# Altium schematic sheet PLL.SchDoc
size 420 x 297 mm; SheetNumber: 6; SheetTotal: 7
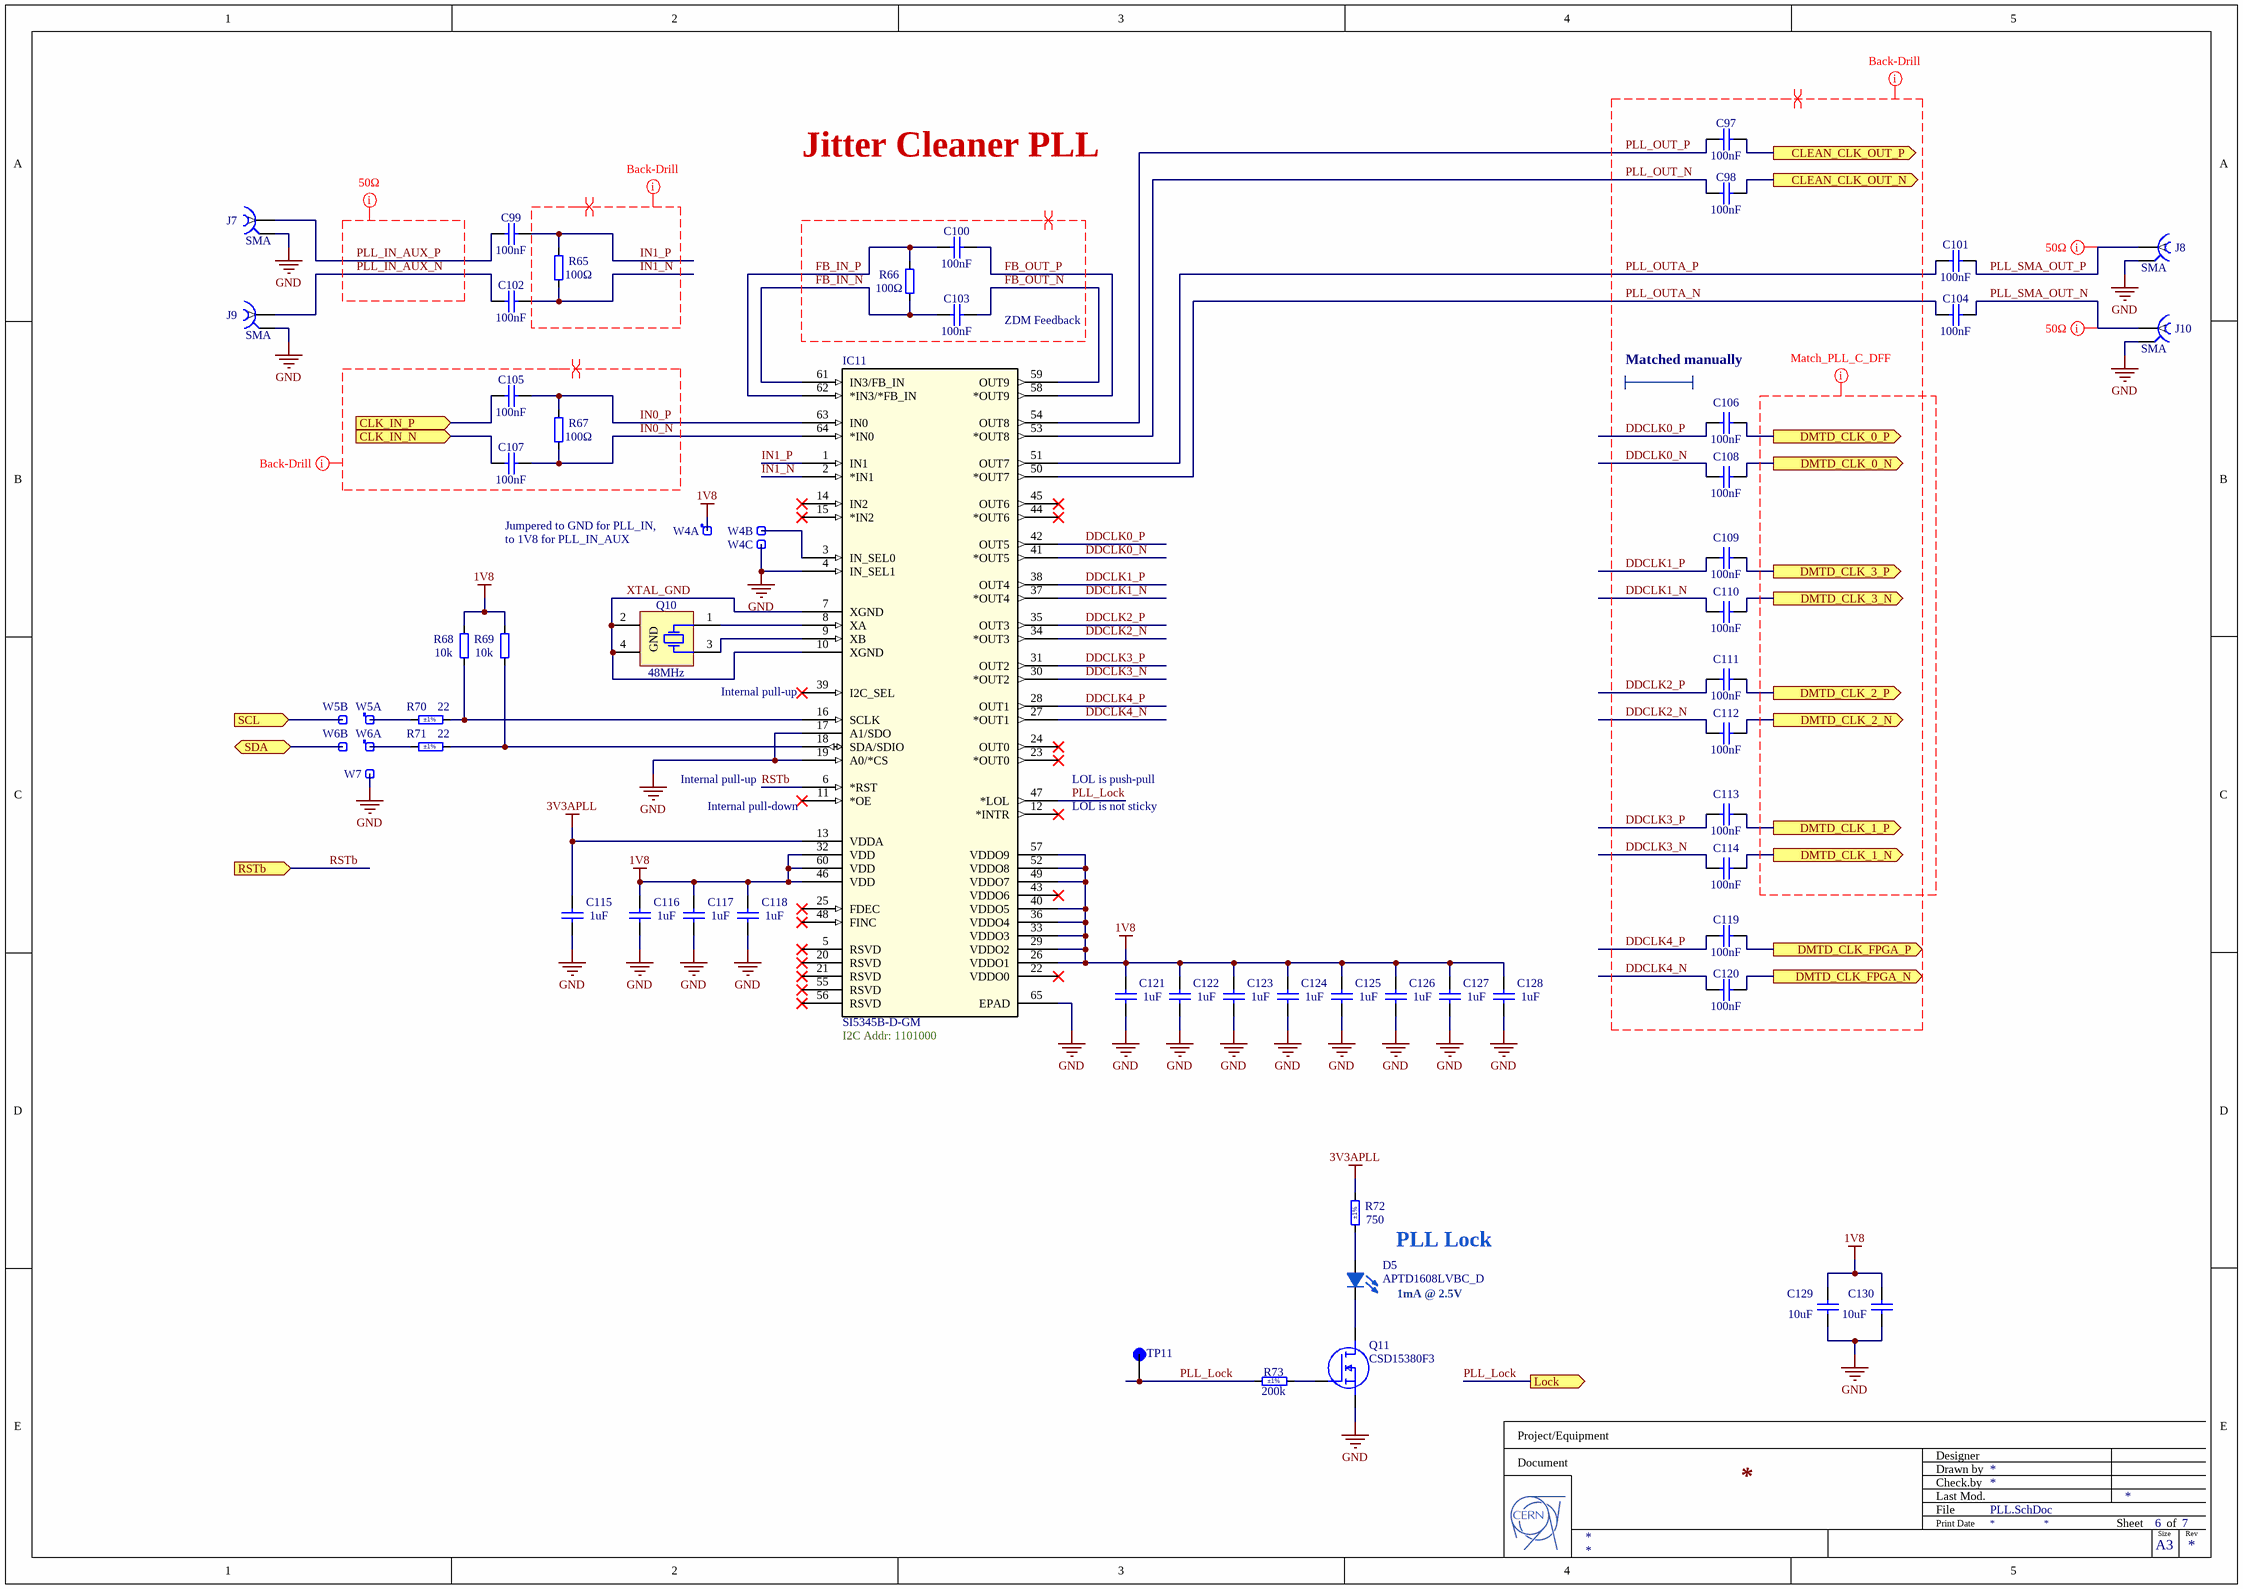
[diagram p0: PLL.SchDoc]

## Parts
C97  100nF  [MURATA_HI_DENSITY_0201]
C98  100nF  [MURATA_HI_DENSITY_0201]
C99  100nF  [MURATA_HI_DENSITY_0201]
C100  100nF  [MURATA_HI_DENSITY_0201]
C101  100nF  [MURATA_HI_DENSITY_0201]
C102  100nF  [MURATA_HI_DENSITY_0201]
C103  100nF  [MURATA_HI_DENSITY_0201]
C104  100nF  [MURATA_HI_DENSITY_0201]
C105  100nF  [MURATA_HI_DENSITY_0201]
C106  100nF  [MURATA_HI_DENSITY_0201]
C107  100nF  [MURATA_HI_DENSITY_0201]
C108  100nF  [MURATA_HI_DENSITY_0201]
C109  100nF  [MURATA_HI_DENSITY_0201]
C110  100nF  [MURATA_HI_DENSITY_0201]
C111  100nF  [MURATA_HI_DENSITY_0201]
C112  100nF  [MURATA_HI_DENSITY_0201]
C113  100nF  [MURATA_HI_DENSITY_0201]
C114  100nF  [MURATA_HI_DENSITY_0201]
C115  1uF  [CAPC1005X55N]
C116  1uF  [CAPC1005X55N]
C117  1uF  [CAPC1005X55N]
C118  1uF  [CAPC1005X55N]
C119  100nF  [MURATA_HI_DENSITY_0201]
C120  100nF  [MURATA_HI_DENSITY_0201]
C121  1uF  [CAPC1005X55N]
C122  1uF  [CAPC1005X55N]
C123  1uF  [CAPC1005X55N]
C124  1uF  [CAPC1005X55N]
C125  1uF  [CAPC1005X55N]
C126  1uF  [CAPC1005X55N]
C127  1uF  [CAPC1005X55N]
C128  1uF  [CAPC1005X55N]
C129  10uF  [CAPC1608X87N]
C130  10uF  [CAPC1608X87N]
D5  APTD1608LVBC_D  [LEDC1608X110N]
IC11  SI5345B-D-GM  [QFN50P900X900X90-65N-D]
J7  SMA  [SAMTEC_SMA-J-P-H-ST-MT1]
J8  SMA  [SAMTEC_SMA-J-P-H-ST-MT1]
J9  SMA  [SAMTEC_SMA-J-P-H-ST-MT1]
J10  SMA  [SAMTEC_SMA-J-P-H-ST-MT1]
Q10  48MHz  [XTAL_KYOCERA_CX3225SB]
Q11  CSD15380F3  [CSD15380F3]
R65  100Ω  [MURATA_HI_DENSITY_0201]
R66  100Ω  [MURATA_HI_DENSITY_0201]
R67  100Ω  [MURATA_HI_DENSITY_0201]
R68  10k  [MURATA_HI_DENSITY_0201]
R69  10k  [MURATA_HI_DENSITY_0201]
R70  22  Tolerance: ±1%  [RESC1005X40N]
R71  22  Tolerance: ±1%  [RESC1005X40N]
R72  750  Tolerance: ±1%  [RESC1005X40N]
R73  200k  Tolerance: ±1%  [RESC1005X40N]
TP11  RCU-0C  [TP+195X110]  (value not drawn)
W4  Header 3  [SAMTEC_HTSW-103-23-L-S]  (value not drawn)  (parts A,B,C of 3)
W5  Header 2  [SAMTEC_HTSW-102-23-L-S]  (value not drawn)  (parts A,B of 2)
W6  Header 2  [SAMTEC_HTSW-102-23-L-S]  (value not drawn)  (parts A,B of 2)
W7  Header 1  [SAMTEC_HTSW-101-23-L-S]  (value not drawn)

## Ports
CLEAN_CLK_OUT_N (out), CLEAN_CLK_OUT_P (out), CLK_IN_N (in), CLK_IN_P (in), DMTD_CLK_0_N (out), DMTD_CLK_0_P (out), DMTD_CLK_1_N (out), DMTD_CLK_1_P (out), DMTD_CLK_2_N (out), DMTD_CLK_2_P (out), DMTD_CLK_3_N (out), DMTD_CLK_3_P (out), DMTD_CLK_FPGA_N (out), DMTD_CLK_FPGA_P (out), Lock (out), RSTb (in), SCL (in), SDA (bidir)

## Nets
1V8: C116.2 C117.2 C118.2 C121.2 C122.2 C123.2 C124.2 C125.2 C126.2 C127.2 C128.2 C129.2 C130.2 IC11.26(VDDO1) IC11.29(VDDO2) IC11.32(VDD) IC11.33(VDDO3) IC11.36(VDDO4) IC11.40(VDDO5) IC11.46(VDD) IC11.49(VDDO7) IC11.52(VDDO8) IC11.57(VDDO9) IC11.60(VDD) R68.2 R69.2 W4.1
3V3APLL: C115.2 IC11.13(VDDA) R72.2
GND: C115.1 C116.1 C117.1 C118.1 C121.1 C122.1 C123.1 C124.1 C125.1 C126.1 C127.1 C128.1 C129.1 C130.1 IC11.4(IN_SEL1) IC11.17(A1/SDO) IC11.19(A0/*CS) IC11.65(EPAD) J7.2 J8.2 J9.2 J10.2 Q11.2(S) W4.3 W7.1
CLEAN_CLK_OUT_N: C98.2 ; port CLEAN_CLK_OUT_N
CLEAN_CLK_OUT_P: C97.2 ; port CLEAN_CLK_OUT_P
CLK_IN_N: C107.2 ; port CLK_IN_N
CLK_IN_P: C105.2 ; port CLK_IN_P
DDCLK0_N: C108.1 IC11.41(*OUT5)
DDCLK0_P: C106.1 IC11.42(OUT5)
DDCLK1_N: C110.1 IC11.37(*OUT4)
DDCLK1_P: C109.1 IC11.38(OUT4)
DDCLK2_N: C112.1 IC11.34(*OUT3)
DDCLK2_P: C111.1 IC11.35(OUT3)
DDCLK3_N: C114.1 IC11.30(*OUT2)
DDCLK3_P: C113.1 IC11.31(OUT2)
DDCLK4_N: C120.1 IC11.27(*OUT1)
DDCLK4_P: C119.1 IC11.28(OUT1)
DMTD_CLK_0_N: C108.2 ; port DMTD_CLK_0_N
DMTD_CLK_0_P: C106.2 ; port DMTD_CLK_0_P
DMTD_CLK_1_N: C114.2 ; port DMTD_CLK_1_N
DMTD_CLK_1_P: C113.2 ; port DMTD_CLK_1_P
DMTD_CLK_2_N: C112.2 ; port DMTD_CLK_2_N
DMTD_CLK_2_P: C111.2 ; port DMTD_CLK_2_P
DMTD_CLK_3_N: C110.2 ; port DMTD_CLK_3_N
DMTD_CLK_3_P: C109.2 ; port DMTD_CLK_3_P
DMTD_CLK_FPGA_N: C120.2 ; port DMTD_CLK_FPGA_N
DMTD_CLK_FPGA_P: C119.2 ; port DMTD_CLK_FPGA_P
FB_IN_N: C103.1 IC11.61(IN3/FB_IN) R66.1
FB_IN_P: C100.1 IC11.62(*IN3/*FB_IN) R66.2
FB_OUT_N: C103.2 IC11.59(OUT9)
FB_OUT_P: C100.2 IC11.58(*OUT9)
IN0_N: C107.1 IC11.64(*IN0) R67.1
IN0_P: C105.1 IC11.63(IN0) R67.2
IN1_N: C102.1 IC11.2(*IN1) R65.1
IN1_P: C99.1 IC11.1(IN1) R65.2
PLL_IN_AUX_N: C102.2 J9.1
PLL_IN_AUX_P: C99.2 J7.1
PLL_Lock: IC11.47(*LOL) R73.1 TP11.1(TP) ; port Lock
PLL_OUT_N: C98.1 IC11.53(*OUT8)
PLL_OUT_P: C97.1 IC11.54(OUT8)
PLL_OUTA_N: C104.1 IC11.50(*OUT7)
PLL_OUTA_P: C101.1 IC11.51(OUT7)
PLL_SMA_OUT_N: C104.2 J10.1
PLL_SMA_OUT_P: C101.2 J8.1
RSTb: IC11.6(*RST) ; port RSTb
SCL: W5.2 ; port SCL
SDA: W6.2 ; port SDA
XTAL_GND: IC11.7(XGND) IC11.10(XGND) Q10.2(GND) Q10.4(GND)
NetD5_1: D5.1(K) Q11.3(D)
NetD5_2: D5.2(A) R72.1
NetIC11_3: IC11.3(IN_SEL0) W4.2
NetIC11_8: IC11.8(XA) Q10.1(X)
NetIC11_9: IC11.9(XB) Q10.3(X)
NetIC11_16: IC11.16(SCLK) R68.1 R70.2
NetIC11_18: IC11.18(SDA/SDIO) R69.1 R71.2
NetQ11_1: Q11.1(G) R73.2
NetR70_1: R70.1 W5.1
NetR71_1: R71.1 W6.1

Not connected (* = marked no-connect by the designer): IC11 5(RSVD)* 11(*OE)* 12(*INTR)* 14(IN2)* 15(*IN2)* 20(RSVD)* 21(RSVD)* 22(VDDO0)* 23(*OUT0)* 24(OUT0)* 25(FDEC)* 39(I2C_SEL)* 43(VDDO6)* 44(*OUT6)* 45(OUT6)* 48(FINC)* 55(RSVD)* 56(RSVD)*

## Layout directives
differential pair: DDCLK0_N, DDCLK0_P, DDCLK1_N, DDCLK1_P, DDCLK2_N, DDCLK2_P, DDCLK3_N, DDCLK3_P, DDCLK4_N, DDCLK4_P, FB_IN_N, FB_IN_P, FB_OUT_N, FB_OUT_P, IN0_N, IN0_P, IN1_N, IN1_P, PLL_OUT_N, PLL_OUT_P, PLL_OUTA_N, PLL_OUTA_P
net class 50ohm: PLL_IN_AUX_N, PLL_IN_AUX_P, PLL_SMA_OUT_N, PLL_SMA_OUT_P
net class Back-Drill: DDCLK0_N, DDCLK0_P, DDCLK1_N, DDCLK1_P, DDCLK2_N, DDCLK2_P, DDCLK3_N, DDCLK3_P, DDCLK4_N, DDCLK4_P, IN0_N, IN0_P, IN1_N, IN1_P, PLL_OUT_N, PLL_OUT_P, PLL_OUTA_N, PLL_OUTA_P
net class Match_PLL_C_DFF: DDCLK0_N, DDCLK0_P, DDCLK1_N, DDCLK1_P, DDCLK2_N, DDCLK2_P, DDCLK3_N, DDCLK3_P, DDCLK4_N, DDCLK4_P, PLL_OUT_N, PLL_OUT_P, PLL_OUTA_N, PLL_OUTA_P

## Notes on the sheet
- Jitter Cleaner PLL
- ZDM Feedback
- Matched manually
- Jumpered to GND for PLL_IN, to 1V8 for PLL_IN_AUX
- (near IC11) Internal pull-up
- Internal pull-up
- LOL is push-pull
- (near IC11) Internal pull-down
- LOL is not sticky
- (near IC11) I2C Addr: 1101000
- PLL Lock
- 1mA @ 2.5V
- Project/Equipment
- Document
- Designer
- Drawn by
- Check.by
- File
- Last Mod.
- Print Date
- Sheet
- Size
- A3
- of
- Rev

## Library data of the parts
C97-C114 C119 C120 = C0201-100nF-high-density: GRM033R61C104KE14; Vmax: 16V; Value: 100nF
C115-C118 C121-C128 = CC0402_1UF_16V_10%_X5R: GRM153B30J105ME15; Part Description: SMD Multilayer Chip Ceramic Capacitor; Manufacturer: GENERIC; Manufacturer1 Part Number: C1005X5R1C105KT; Voltage: 16V; TC: X5R; Tolerance: ±10%; Part Number: CC0402_1UF_16V_10%_X5R; Component Kind: Standard; Component Type: Standard; Pin Count: 2; Value: 1uF; Status: Preferred; Manufacturer Part Number: CC0402_1UF_16V_10%_X5R; Case: 0402; Mounted: Yes; Socket: No; SMD: Yes; Sense: No; Manufacturer1 Example: TDK; Manufacturer1 ComponentHeight: 0.55mm; HelpURL: \\cern.ch\dfs\Applications\Altium\Datasheets\CC0402_X5R_TDK_C.pdf; Author: CERN DEM JLC; CreateDate: 10/25/2012; LatestRevisionDate: 10/25/2012
C129 C130 = CC0603_10UF_6.3V_20%_X5R: C1608X5R1E106M080AC; Part Description: SMD Multilayer Chip Ceramic Capacitor; Manufacturer: GENERIC; Manufacturer1 Part Number: C0603C106M9PAC; Voltage: 6.3V; TC: X5R; Tolerance: ±20%; Part Number: CC0603_10UF_6.3V_20%_X5R; Component Kind: Standard; Component Type: Standard; Pin Count: 2; Value: 10uF; Status: Preferred; Manufacturer Part Number: CC0603_10uF_6.3V_20%_X5R; Case: 0603; Mounted: Yes; Socket: No; SMD: Yes; Sense: No; Manufacturer1 Example: KEMET; Manufacturer1 ComponentHeight: 0.95mm; HelpURL: \\cern.ch\dfs\Applications\Altium\Datasheets\CC0603_X5R_KEMET.pdf; Author: CERN DEM JLC; CreateDate: 03/12/2007; LatestRevisionDate: 03/12/2007
D5 = APTD1608LVBC_D: LED; Manufacturer_Name: Kingbright; Manufacturer_Part_Number: APTD1608LVBC/D; Datasheet Link: https://componentsearchengine.com/Datasheets/1/APTD1608LVBC_D.pdf; Height: 1.1mm; Mouser Part Number: 604-APTD1608LVBCD; Mouser Price/Stock: https://www.mouser.co.uk/ProductDetail/Kingbright/APTD1608LVBC-D?qs=6oMev5NRZMEfNSg5xIhlKA%3D%3D; Arrow Part Number: APTD1608LVBC/D; Arrow Price/Stock: https://www.arrow.com/en/products/aptd1608lvbcd/kingbright?utm_currency=USD&region=nac
IC11 = SI5345B-D-GM: Integrated Circuit; Manufacturer_Name: Skyworks; Datasheet Link: https://www.mouser.sg/datasheet/2/472/si5345_44_42_d_datasheet-2507675.pdf; Height: 0.9mm; Manufacturer_Part_Number: SI5345B-D-GM; Mouser Part Number: 634-SI5345B-D-GM; Mouser Price/Stock: https://www.mouser.co.uk/ProductDetail/Skyworks-Solutions-Inc/SI5345B-D-GM?qs=p9T7GgSe1IGHqFUKlxUKrA%3D%3D
J7-J10 = SAMTEC_SMA-J-P-H-ST-MT1: Part Description: 50 Ohms SMA Straight Mixed Technology PCB Jack; Manufacturer: SAMTEC; PressFit: No; Sense Comment: assembly limitations; Part Number: SAMTEC_SMA-J-P-H-ST-MT1; Component Kind: Standard; Component Type: Standard; Pin Count: 5; Family: SMA; Mounted: Yes; Socket: No; SMD: Yes; Sense: Yes; Status: Not Recommended; Manufacturer Part Number: SMA-J-P-H-ST-MT1; ComponentHeight: 7.95mm; HelpURL: \\cern.ch\dfs\Applications\Altium\Datasheets\SAMTEC_SMA-J-P-H-ST-MT1.pdf; Author: CERN DEM HF; CreateDate: 5/24/2023; LatestRevisionDate: 5/24/2023
Q10 = XTAL_48MHZ_KYOCERA_CX3225SB48000D0FPJC1: Crystal 4 pins 1=XTAL Control 2=GND3=XTAL 4=GND; Part Description: Tolerance: ±10ppm, Stability: ±15ppm, 8pF, -40°C to +85°C, Surface Mount Crystal; PressFit: No; Bonding: No; Part Number: XTAL_48MHZ_KYOCERA_CX3225SB48000D0FPJC1; Component Kind: Standard; Component Type: Standard; PackageDescription: SMD Crystal Kyocera, 4 Pins, 2.50mm L X 3.20mm W X 0.6mm H; Value: 48MHz; Manufacturer: KYOCERA; Manufacturer Part Number: CX3225SB48000D0FPJC1; Pin Count: 4; Mounted: Yes; Socket: No; SMD: Yes; Sense: No; ComponentHeight: 0.6mm; HelpURL: \\cern.ch\dfs\Applications\Altium\Datasheets\XTAL_KYOCERA_CX3225SB.pdf; Author: CERN DEM JLC; CreateDate: 6/5/2018; LatestRevisionDate: 6/5/2018
Q11 = CSD15380F3: MOSFET (N-Channel); Manufacturer_Name: Texas Instruments; Datasheet Link: https://www.ti.com/lit/ds/symlink/csd15380f3.pdf?ts=1641221366106&ref_url=https%253A%252F%252Fwww.google.com%252F; Height: 0.35mm; Manufacturer_Part_Number: CSD15380F3; Mouser Part Number: 595-CSD15380F3; Mouser Price/Stock: https://www.mouser.co.uk/ProductDetail/Texas-Instruments/CSD15380F3?qs=zEmsApcVOkXP46xhm0edmA%3D%3D; Arrow Part Number: CSD15380F3; Arrow Price/Stock: https://www.arrow.com/en/products/csd15380f3/texas-instruments?region=nac
R65-R67 = R0201-100ohm-high-density: Resistor; Value: 100Ω
R68 R69 = R0201-100ohm-high-density: Resistor 10k; Value: 100Ω
R70 R71 = R0402_22R_1%_0.0625W_100PPM: Resistor - 1%; Part Description: General Purpose Thick Film Chip Resistor; Manufacturer: GENERIC; Manufacturer1 Part Number: 232270672209L; TC: ±100ppm/°C; PressFit: No; Part Number: R0402_22R_1%_0.0625W_100PPM; Component Kind: Standard; Component Type: Standard; Pin Count: 2; Value: 22; Status: Not Recommended; Power: 0.0625W; Manufacturer Part Number: R0402_22R_1%_0.0625W_100PPM; Case: 0402; Mounted: Yes; Sense: No; Socket: No; SMD: Yes; Manufacturer1 Example: YAGEO PHYCOMP; Manufacturer1 ComponentHeight: 0.4mm; HelpURL: \\cern.ch\dfs\Applications\Altium\Datasheets\R0402_Phycomp_RC0402.pdf; Author: CERN DEM JLC; CreateDate: 12/3/2007; LatestRevisionDate: 10/17/2012
R72 = R0402_750R_1%_0.0625W_100PPM: Resistor - 1%; Part Description: General Purpose Thick Film Chip Resistor; Manufacturer: GENERIC; Manufacturer1 Part Number: 232270677501L; TC: ±100ppm/°C; PressFit: No; Part Number: R0402_750R_1%_0.0625W_100PPM; Component Kind: Standard; Component Type: Standard; Pin Count: 2; Value: 750; Status: Not Recommended; Power: 0.0625W; Manufacturer Part Number: R0402_750R_1%_0.0625W_100PPM; Case: 0402; Mounted: Yes; Sense: No; Socket: No; SMD: Yes; Manufacturer1 Example: YAGEO PHYCOMP; Manufacturer1 ComponentHeight: 0.4mm; HelpURL: \\cern.ch\dfs\Applications\Altium\Datasheets\R0402_Phycomp_RC0402.pdf; Author: CERN DEM JLC; CreateDate: 12/3/2007; LatestRevisionDate: 10/17/2012
R73 = R0402_200K_1%_0.0625W_100PPM: Resistor - 1%; Part Description: General Purpose Thick Film Chip Resistor; Manufacturer: GENERIC; Manufacturer1 Part Number: 232270672004L; TC: ±100ppm/°C; PressFit: No; Part Number: R0402_200K_1%_0.0625W_100PPM; Component Kind: Standard; Component Type: Standard; Pin Count: 2; Value: 200k; Status: Not Recommended; Power: 0.0625W; Manufacturer Part Number: R0402_200K_1%_0.0625W_100PPM; Case: 0402; Mounted: Yes; Sense: No; Socket: No; SMD: Yes; Manufacturer1 Example: YAGEO PHYCOMP; Manufacturer1 ComponentHeight: 0.4mm; HelpURL: \\cern.ch\dfs\Applications\Altium\Datasheets\R0402_Phycomp_RC0402.pdf; Author: CERN DEM JLC; CreateDate: 12/3/2007; LatestRevisionDate: 10/17/2012
TP11 = RCU-0C: MF: {'manufacturer': u'TE Connectivity AMP Connectors'}; Package: None; Price: None; Value: *; MP: RCU-0C; Availability: Unavailable
W4 = SAMTEC_HTSW-103-23-L-S: 3 Mini Wire-Wrap Contact Strip Header; Part Description: 3 Contacts, Pitch 2.54mm, Single Row Through Mount Straight Header (Post Lead 5.84mm, Tail Lead 2.92mm, Insulator 2.54mm); Manufacturer: SAMTEC; PressFit: No; Status Comment: High Temperature; Part Number: SAMTEC_HTSW-103-23-L-S; Component Kind: Standard; Component Type: Standard; Pin Count: 3; Family: Header 3; Mounted: Yes; Socket: No; SMD: No; Sense: No; Status: Preferred; Manufacturer Part Number: HTSW-103-23-L-S; ComponentHeight: 8.38mm; HelpURL: \\cern.ch\dfs\Applications\Altium\Datasheets\SAMTEC_HTSW-103-23-L-S.pdf; Author: CERN DEM JLC; CreateDate: 2/22/2018; LatestRevisionDate: 2/22/2018
W5 W6 = SAMTEC_HTSW-102-23-L-S: 2 Mini Wire-Wrap Contact Strip Header; Part Description: 2 Contacts, Pitch 2.54mm, Single Row  Through Mount Straight Header (Post Lead 5.84mm, Tail Lead 2.92mm, Insulator 2.54mm); Manufacturer: SAMTEC; PressFit: No; Status Comment: High Temperature; Part Number: SAMTEC_HTSW-102-23-L-S; Component Kind: Standard; Component Type: Standard; Pin Count: 2; Family: Header 2; Mounted: Yes; Socket: No; SMD: No; Sense: No; Status: Preferred; Manufacturer Part Number: HTSW-102-23-L-S; ComponentHeight: 8.38mm; HelpURL: \\cern.ch\dfs\Applications\Altium\Datasheets\SAMTEC_HTSW-102-23-L-S.pdf; Author: CERN DEM JLC; CreateDate: 2/22/2018; LatestRevisionDate: 2/22/2018
W7 = SAMTEC_HTSW-101-23-L-S: Single Mini Wire-Wrap Contact; Part Description: Single Contact Through Mount Straight Header (Post Lead 5.84mm, Tail Lead 2.92mm, Insulator 2.54mm); Manufacturer: SAMTEC; PressFit: No; Status Comment: High Temperature; Part Number: SAMTEC_HTSW-101-23-L-S; Component Kind: Standard; Component Type: Standard; Pin Count: 1; Family: Header 1; Mounted: Yes; Socket: No; SMD: No; Sense: No; Status: Preferred; Manufacturer Part Number: HTSW-101-23-L-S; ComponentHeight: 8.38mm; HelpURL: \\cern.ch\dfs\Applications\Altium\Datasheets\SAMTEC_HTSW-101-23-L-S.pdf; Author: CERN DEM JLC; CreateDate: 2/22/2018; LatestRevisionDate: 2/22/2018